# EAGLE schematic facebard-7-sensor-led (EAGLE 9.6.2)
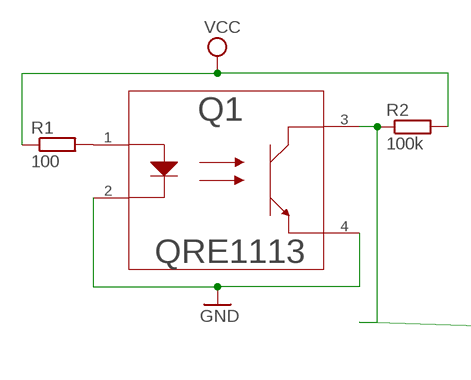
[diagram p0: schematic, sheet 1, part 1 of 2]
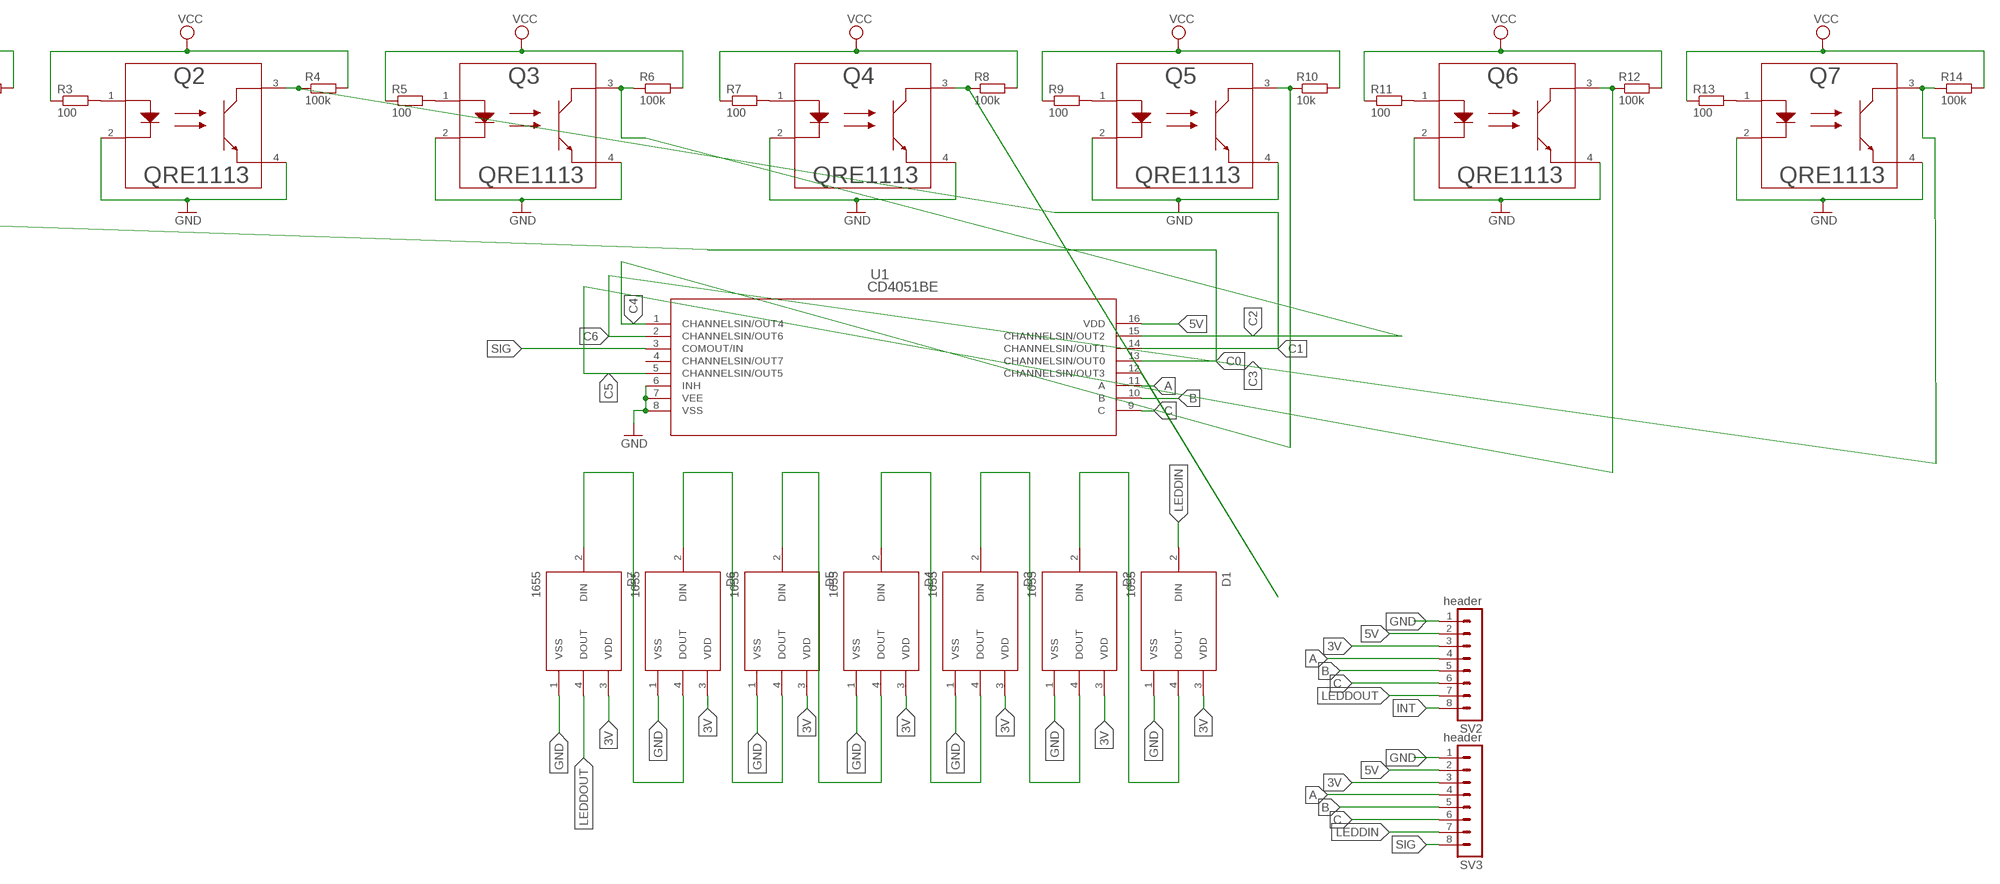
[diagram p1: schematic, sheet 1, part 2 of 2]

## Parts
D1  1655  [LED_1655]
D2  1655  [LED_1655]
D3  1655  [LED_1655]
D4  1655  [LED_1655]
D5  1655  [LED_1655]
D6  1655  [LED_1655]
D7  1655  [LED_1655]
Q1  QRE1113  [DIP4_100AQ_ONS]
Q2  QRE1113  [DIP4_100AQ_ONS]
Q3  QRE1113  [DIP4_100AQ_ONS]
Q4  QRE1113  [DIP4_100AQ_ONS]
Q5  QRE1113  [DIP4_100AQ_ONS]
Q6  QRE1113  [DIP4_100AQ_ONS]
Q7  QRE1113  [DIP4_100AQ_ONS]
R1  100  R-EU_0207/10  [0207/10]
R2  100k  R-EU_0207/10  [0207/10]
R3  100  R-EU_0207/10  [0207/10]
R4  100k  R-EU_0207/10  [0207/10]
R5  100  R-EU_0207/10  [0207/10]
R6  100k  R-EU_0207/10  [0207/10]
R7  100  R-EU_0207/10  [0207/10]
R8  100k  R-EU_0207/10  [0207/10]
R9  100  R-EU_0207/10  [0207/10]
R10  10k  R-EU_0207/10  [0207/10]
R11  100  R-EU_0207/10  [0207/10]
R12  100k  R-EU_0207/10  [0207/10]
R13  100  R-EU_0207/10  [0207/10]
R14  100k  R-EU_0207/10  [0207/10]
SV2  header  MA08-1  [MA08-1]
SV3  header  MA08-1  [MA08-1]
U1  CD4051BE  [N16]

## Nets
3V: D1.3(VDD) D2.3(VDD) D3.3(VDD) D4.3(VDD) D5.3(VDD) D6.3(VDD) D7.3(VDD) SV2.3 SV3.3
5V: R1.1 R2.2 R3.1 R4.2 R5.1 R6.2 R7.1 R8.2 R9.1 R10.2 R11.1 R12.2 R13.1 R14.2 SV2.2 SV3.2 U1.16(VDD) ; supply symbol labelled VCC
A: SV2.4 SV3.4 U1.11(A)
B: SV2.5 SV3.5 U1.10(B)
C: SV2.6 SV3.6 U1.9(C)
C0: Q1.3 R2.1 U1.13(CHANNELSIN/OUT0)
C1: Q2.3 R4.1 U1.14(CHANNELSIN/OUT1)
C2: Q3.3 R6.1 U1.15(CHANNELSIN/OUT2)
C3: Q4.3 R8.1 U1.12(CHANNELSIN/OUT3)
C4: Q5.3 R10.1 U1.1(CHANNELSIN/OUT4)
C5: Q6.3 R12.1 U1.5(CHANNELSIN/OUT5)
C6: Q7.3 R14.1 U1.2(CHANNELSIN/OUT6)
GND: D1.1(VSS) D2.1(VSS) D3.1(VSS) D4.1(VSS) D5.1(VSS) D6.1(VSS) D7.1(VSS) Q1.2 Q1.4 Q2.2 Q2.4 Q3.2 Q3.4 Q4.2 Q4.4 Q5.2 Q5.4 Q6.2 Q6.4 Q7.2 Q7.4 SV2.1 SV3.1 U1.6(INH) U1.7(VEE) U1.8(VSS)
INT: SV2.8
LEDDIN: D1.2(DIN) SV3.7
LEDDOUT: D7.4(DOUT) SV2.7
N$1: Q1.1 R1.2
N$3: Q2.1 R3.2
N$5: Q3.1 R5.2
N$7: Q4.1 R7.2
N$9: Q5.1 R9.2
N$11: Q6.1 R11.2
N$13: Q7.1 R13.2
N$29: D1.4(DOUT) D2.2(DIN)
N$30: D2.4(DOUT) D3.2(DIN)
N$31: D3.4(DOUT) D4.2(DIN)
N$32: D4.4(DOUT) D5.2(DIN)
N$33: D5.4(DOUT) D6.2(DIN)
N$34: D6.4(DOUT) D7.2(DIN)
SIG: SV3.8 U1.3(COMOUT/IN)
Unconnected: U1.4(CHANNELSIN/OUT7)

## Library data of the parts
D1-D7 = 1655:1655: Ws2812b 5050 Rgb Led With Integrated Driver Chip Pack Of 10; MANUFACTURER: Adafruit Industries; MAXIMUM_PACKAGE_HEIGHT: 1.6 mm; PARTREV: 01; STANDARD: Manufacturer recommendations
Q1-Q7 = qre1113:QRE1113; COPYRIGHT: Copyright (C) 2024 Ultra Librarian. All rights reserved.; MANUFACTURER_PART_NUMBER: QRE1113; MFR_NAME: onsemi
R1-R14 = rcl:R-EU_: RESISTOR, European symbol; SPICEPREFIX: R
SV2 = con-lstb:MA08-1: PIN HEADER; OC_FARNELL: unknown; OC_NEWARK: unknown; SPICEPREFIX: X
SV3 = con-lstb:MA08-1: PIN HEADER; OC_FARNELL: unknown; OC_NEWARK: unknown
U1 = CD4051BE:CD4051BE; COPYRIGHT: Copyright (C) 2024 Ultra Librarian. All rights reserved.; MANUFACTURER_PART_NUMBER: CD4051BE; MFR_NAME: Texas Instruments